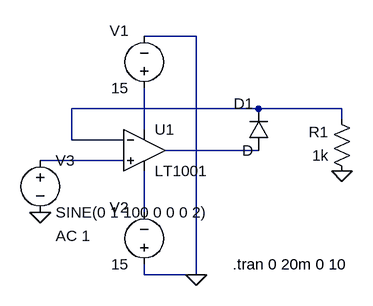
[diagram p0: schematic Half wave rectifer.asc]
Half wave rectifer.asc, the LTspice schematic file:
Version 4
SHEET 1 880 680
WIRE 192 96 112 96
WIRE 288 208 0 208
WIRE 416 208 288 208
WIRE 416 224 416 208
WIRE 112 240 112 176
WIRE 0 256 0 208
WIRE 80 256 0 256
WIRE 288 272 144 272
WIRE 80 288 -48 288
WIRE 112 368 112 304
WIRE 112 464 112 448
WIRE 192 464 192 96
WIRE 192 464 112 464
FLAG 192 464 0
FLAG 416 304 0
FLAG -48 368 0
SYMBOL Opamps\\LT1001 112 208 R0
SYMATTR InstName U1
SYMBOL voltage 112 192 R180
WINDOW 0 24 104 Left 0
WINDOW 3 24 16 Left 0
WINDOW 123 0 0 Left 0
WINDOW 39 0 0 Left 0
SYMATTR InstName V1
SYMATTR Value 15
SYMBOL voltage 112 464 R180
WINDOW 0 24 104 Left 0
WINDOW 3 24 16 Left 0
WINDOW 123 0 0 Left 0
WINDOW 39 0 0 Left 0
SYMATTR InstName V2
SYMATTR Value 15
SYMBOL voltage -48 272 R0
WINDOW 123 24 132 Left 0
WINDOW 39 0 0 Left 0
SYMATTR InstName V3
SYMATTR Value SINE(0 1 100 0 0 0 2)
SYMATTR Value2 AC 1
SYMBOL res 432 320 R180
WINDOW 0 36 76 Left 0
WINDOW 3 36 40 Left 0
SYMATTR InstName R1
SYMATTR Value 1k
SYMBOL diode 304 272 R180
WINDOW 0 24 72 Left 0
WINDOW 3 24 0 Left 0
SYMATTR InstName D1
TEXT 248 448 Left 0 !.tran 0 20m 0 10

The netlist it stands for:
* Half wave rectifer.asc
XU1 N004 N001 N002 N005 N003 LT1001  ; pins In+ In- V+ V- OUT
V1 N002 0 15
V2 0 N005 15
V3 N004 0 SINE(0 1 100 0 0 0 2) AC 1
R1 0 N001 1k
D1 N003 N001 D
.model D D
.lib standard.dio
.tran 0 20m 0 10
.lib LTC.lib
.backanno
.end